# Altium schematic sheet NRV-MEM-LCD.SchDoc
size D
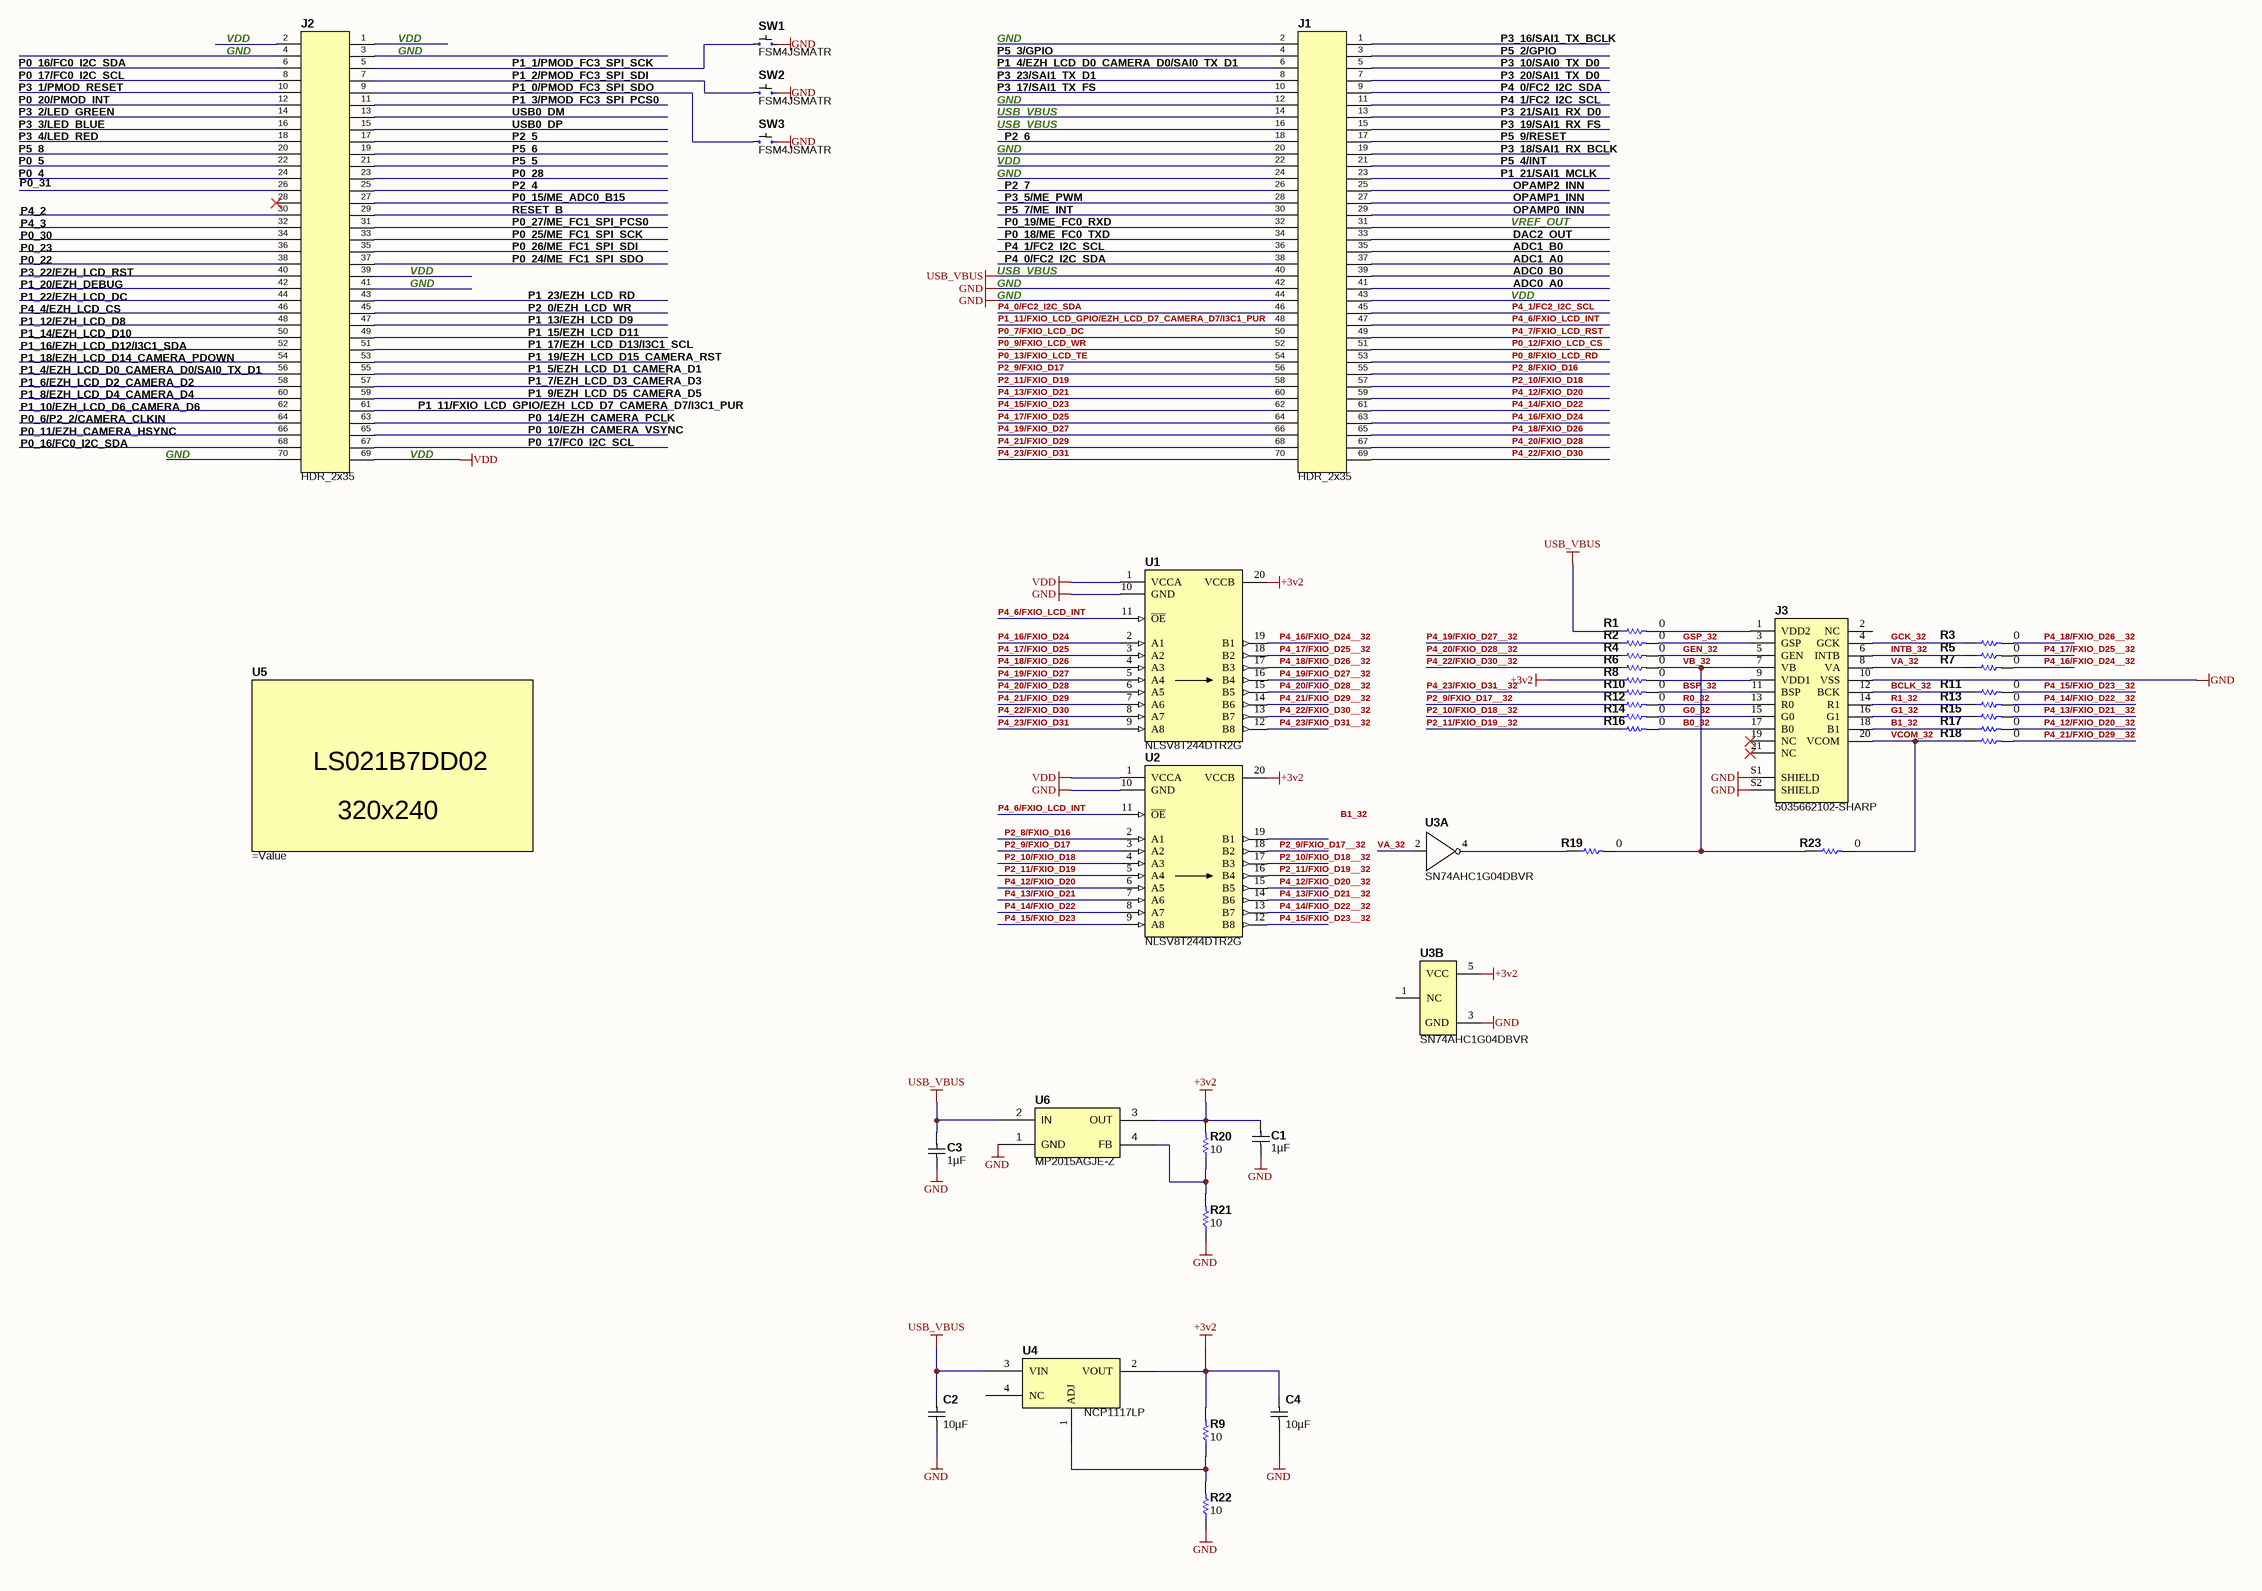
[diagram p0: NRV-MEM-LCD.SchDoc]

## Parts
C1  1µF  [C0805_1.40MM_MD]
C2  10µF  [C0805_1.40MM_MD]
C3  1µF  [C0805_1.40MM_MD]
C4  10µF  [C0805_1.40MM_MD]
J1  HDR_2x35  [HEADER 2x35 .100"]
J2  HDR_2x35  [HEADER 2x35 .100"]
J3  5035662102-SHARP  [MOLEX_5035662102]
R1  0  [R0603_0.55MM_MD]
R2  0  [R0603_0.55MM_MD]
R3  0  [R0603_0.55MM_MD]
R4  0  [R0603_0.55MM_MD]
R5  0  [R0603_0.55MM_MD]
R6  0  [R0603_0.55MM_MD]
R7  0  [R0603_0.55MM_MD]
R8  0  [R0603_0.55MM_MD]
R9  10  [R0603_0.55MM_MD]
R10  0  [R0603_0.55MM_MD]
R11  0  [R0603_0.55MM_MD]
R12  0  [R0603_0.55MM_MD]
R13  0  [R0603_0.55MM_MD]
R14  0  [R0603_0.55MM_MD]
R15  0  [R0603_0.55MM_MD]
R16  0  [R0603_0.55MM_MD]
R17  0  [R0603_0.55MM_MD]
R18  0  [R0603_0.55MM_MD]
R19  0  [R0603_0.55MM_MD]
R20  10  [R0603_0.55MM_MD]
R21  10  [R0603_0.55MM_MD]
R22  10  [R0603_0.55MM_MD]
R23  0  [R0603_0.55MM_MD]
SW1  FSM4JSMATR  [FSM4JSMA]
SW2  FSM4JSMATR  [FSM4JSMA]
SW3  FSM4JSMATR  [FSM4JSMA]
U1  NLSV8T244DTR2G  [TSOP65P640X105-20N]
U2  NLSV8T244DTR2G  [TSOP65P640X105-20N]
U3  SN74AHC1G04DBVR  [SOT95P245X145-5L]  (parts A,B of 2)
U4  NCP1117LP  [SOT223]
U5  (no value)  [LS021B7DD02]
U6  MP2015AGJE-Z  [SOT23-4]

## Nets
+3v2: C1.2 C4.2 R8.1 R9.2 R20.2 U1.20(VCCB) U2.20(VCCB) U3.5(VCC) U4.2(VOUT) U6.3(OUT)
GND: C1.1 C2.1 C3.1 C4.1 J1.42 J1.44 J3.10(VSS) J3.S1(SHIELD) J3.S2(SHIELD) R21.1 R22.1 SW1.A SW2.A SW3.A U1.10(GND) U2.10(GND) U3.3(GND) U6.1(GND)
USB_VBUS: C2.2 C3.2 J1.40 R1.1 U4.3(VIN) U6.2(IN)
VDD: J2.69 U1.1(VCCA) U2.1(VCCA)
B0_32: J3.17(B0) R16.2
B1_32: J3.18(B1) R17.1
BCLK_32: J3.12(BCK) R11.1
BSP_32: J3.11(BSP) R10.2
G0_32: J3.15(G0) R14.2
G1_32: J3.16(G1) R15.1
GCK_32: J3.4(GCK) R3.1
GEN_32: J3.5(GEN) R4.2
GSP_32: J3.3(GSP) R2.2
INTB_32: J3.6(INTB) R5.1
P0_7/FXIO_LCD_DC: J1.50
P0_8/FXIO_LCD_RD: J1.53
P0_9/FXIO_LCD_WR: J1.52
P0_12/FXIO_LCD_CS: J1.51
P0_13/FXIO_LCD_TE: J1.54
P1_11/FXIO_LCD_GPIO/EZH_LCD_D7_CAMERA_D7/I3C1_PUR: J1.48
P2_8/FXIO_D16: J1.55 U2.2(A1)
P2_9/FXIO_D17: J1.56 U2.3(A2)
P2_9/FXIO_D17__32: R12.1 U2.18(B2)
P2_10/FXIO_D18: J1.57 U2.4(A3)
P2_10/FXIO_D18__32: R14.1 U2.17(B3)
P2_11/FXIO_D19: J1.58 U2.5(A4)
P2_11/FXIO_D19__32: R16.1 U2.16(B4)
P4_0/FC2_I2C_SDA: J1.46
P4_1/FC2_I2C_SCL: J1.45
P4_6/FXIO_LCD_INT: J1.47 U1.11(~{OE}) U2.11(~{OE})
P4_7/FXIO_LCD_RST: J1.49
P4_12/FXIO_D20: J1.59 U2.6(A5)
P4_12/FXIO_D20__32: R17.2 U2.15(B5)
P4_13/FXIO_D21: J1.60 U2.7(A6)
P4_13/FXIO_D21__32: R15.2 U2.14(B6)
P4_14/FXIO_D22: J1.61 U2.8(A7)
P4_14/FXIO_D22__32: R13.2 U2.13(B7)
P4_15/FXIO_D23: J1.62 U2.9(A8)
P4_15/FXIO_D23__32: R11.2 U2.12(B8)
P4_16/FXIO_D24: J1.63 U1.2(A1)
P4_16/FXIO_D24__32: R7.2 U1.19(B1)
P4_17/FXIO_D25: J1.64 U1.3(A2)
P4_17/FXIO_D25__32: R5.2 U1.18(B2)
P4_18/FXIO_D26: J1.65 U1.4(A3)
P4_18/FXIO_D26__32: R3.2 U1.17(B3)
P4_19/FXIO_D27: J1.66 U1.5(A4)
P4_19/FXIO_D27__32: R2.1 U1.16(B4)
P4_20/FXIO_D28: J1.67 U1.6(A5)
P4_20/FXIO_D28__32: R4.1 U1.15(B5)
P4_21/FXIO_D29: J1.68 U1.7(A6)
P4_21/FXIO_D29__32: R18.2 U1.14(B6)
P4_22/FXIO_D30: J1.69 U1.8(A7)
P4_22/FXIO_D30__32: R6.1 U1.13(B7)
P4_23/FXIO_D31: J1.70 U1.9(A8)
P4_23/FXIO_D31__32: R10.1 U1.12(B8)
R0_32: J3.13(R0) R12.2
R1_32: J3.14(R1) R13.1
VA_32: J3.8(VA) R7.1 U3.2(A)
VB_32: J3.7(VB) R6.2 R19.2 R23.1
VCOM_32: J3.20(VCOM) R18.1 R23.2
NetJ2_5: J2.5 SW1.B
NetJ2_7: J2.7 SW2.B
NetJ2_9: J2.9 SW3.B
NetJ3_1: J3.1(VDD2) R1.2
NetJ3_9: J3.9(VDD1) R8.2
NetR9_1: R9.1 R22.2 U4.1(ADJ)
NetR19_1: R19.1 U3.4(OUT)
NetR20_1: R20.1 R21.2 U6.4(FB)

Not connected (* = marked no-connect by the designer): J1 1 2 3 4 5 6 7 8 9 10 11 12 13 14 15 16 17 18 19 20 21 22 23 24 25 26 27 28 29 30 31 32 33 34 35 36 37 38 39 41 43; J2 1 2 3 4 6 8 10 11 12 13 14 15 16 17 18 19 20 21 22 23 24 25 26 27 28* 29 30 31 32 33 34 35 36 37 38 39 40 41 42 43 44 45 46 47 48 49 50 51 52 53 54 55 56 57 58 59 60 61 62 63 64 65 66 67 68 70; J3 2(NC) 19(NC)* 21(NC)*; U2 19(B1); U3 1(NC); U4 4(NC)

## Notes on the sheet
- VDD
- GND
- (near J2) VDD
- (near J2) GND
- P5_3/GPIO
- P3_16/SAI1_TX_BCLK
- P5_2/GPIO
- P0_16/FC0_I2C_SDA
- P0_17/FC0_I2C_SCL
- P3_1/PMOD_RESET
- P0_20/PMOD_INT
- P3_2/LED_GREEN
- P1_1/PMOD_FC3_SPI_SCK
- P1_2/PMOD_FC3_SPI_SDI
- P1_0/PMOD_FC3_SPI_SDO
- P1_3/PMOD_FC3_SPI_PCS0
- USB0_DM
- P1_4/EZH_LCD_D0_CAMERA_D0/SAI0_TX_D1
- P3_23/SAI1_TX_D1
- P3_17/SAI1_TX_FS
- USB_VBUS
- P3_10/SAI0_TX_D0
- P3_20/SAI1_TX_D0
- P4_0/FC2_I2C_SDA
- P4_1/FC2_I2C_SCL
- P3_21/SAI1_RX_D0
- P3_3/LED_BLUE
- P3_4/LED_RED
- P5_8
- P0_5
- P0_4
- USB0_DP
- P2_5
- P5_6
- P5_5
- P0_28
- P2_6
- P3_19/SAI1_RX_FS
- P5_9/RESET
- P3_18/SAI1_RX_BCLK
- P5_4/INT
- P1_21/SAI1_MCLK
- P0_31
- P4_2
- P4_3
- P0_30
- P2_4
- P0_15/ME_ADC0_B15
- RESET_B
- P0_27/ME_FC1_SPI_PCS0
- P0_25/ME_FC1_SPI_SCK
- P2_7
- P3_5/ME_PWM
- P5_7/ME_INT
- P0_19/ME_FC0_RXD
- P0_18/ME_FC0_TXD
- VREF_OUT
- OPAMP2_INN
- OPAMP1_INN
- OPAMP0_INN
- DAC2_OUT
- P0_23
- P0_22
- P3_22/EZH_LCD_RST
- P1_20/EZH_DEBUG
- P1_22/EZH_LCD_DC
- P0_26/ME_FC1_SPI_SDI
- P0_24/ME_FC1_SPI_SDO
- P1_23/EZH_LCD_RD
- ADC1_B0
- ADC1_A0
- ADC0_B0
- ADC0_A0
- P4_4/EZH_LCD_CS
- P1_12/EZH_LCD_D8
- P1_14/EZH_LCD_D10
- P1_16/EZH_LCD_D12/I3C1_SDA
- P1_18/EZH_LCD_D14_CAMERA_PDOWN
- P2_0/EZH_LCD_WR
- P1_13/EZH_LCD_D9
- P1_15/EZH_LCD_D11
- P1_17/EZH_LCD_D13/I3C1_SCL
- P1_19/EZH_LCD_D15_CAMERA_RST
- P1_6/EZH_LCD_D2_CAMERA_D2
- P1_8/EZH_LCD_D4_CAMERA_D4
- P1_10/EZH_LCD_D6_CAMERA_D6
- P0_6/P2_2/CAMERA_CLKIN
- P1_11/FXIO_LCD_GPIO/EZH_LCD_D7_CAMERA_D7/I3C1_PUR
- P1_5/EZH_LCD_D1_CAMERA_D1
- P1_7/EZH_LCD_D3_CAMERA_D3
- P1_9/EZH_LCD_D5_CAMERA_D5
- P0_14/EZH_CAMERA_PCLK
- P0_11/EZH_CAMERA_HSYNC
- P0_10/EZH_CAMERA_VSYNC
- Labels drawn without touching a wire or pin: B1_32
- PCB REV
- CCA REV
- Sheet
- of
- (in symbol LS021B7DD02) 320x240

## Library data of the parts
C1 C3 = GCM21BR71C105KA58K: CAP CER 1UF 16V X7R 0805; Manufacturer: Murata Electronics; Tolerance: ±10%; Substitution Notes: 1µF , 16V , ±10% , X7R , -55°C ~ 125°C , AEC-Q200 , 0805; Value: 1µF; Temperature Coefficient: X7R; Manufacturer Part Number: GCM21BR71C105KA58K; ComponentLink1Description: Datasheet (Internal); ComponentLink1URL: https://search.murata.co.jp/Ceramy/image/img/A01X/G101/ENG/GCM21BR71C105KA58-01.pdf; ComponentLink2Description: Datasheet (External); ComponentLink2URL: https://search.murata.co.jp/Ceramy/image/img/A01X/G101/ENG/GCM21BR71C105KA58-01.pdf; Supplier 1: Digikey; Supplier Part Number 1: 490-16269-1-ND; Category: Capacitors; Voltage - Rated: 16V; Operating Temperature: -55°C ~ 125°C; Ratings: AEC-Q200; Package: 0805; Thickness (Max): 1.40MM
C2 C4 = GCM21BR71A106KE22K: CAP CER 10UF 10V X7R 0805; Manufacturer: Murata Electronics; Tolerance: ±10%; Substitution Notes: 10µF , 10V , ±10% , X7R , -55°C ~ 125°C , AEC-Q200 , 0805; Value: 10µF; Temperature Coefficient: X7R; Manufacturer Part Number: GCM21BR71A106KE22K; ComponentLink1Description: Datasheet (Internal); ComponentLink1URL: https://search.murata.co.jp/Ceramy/image/img/A01X/G101/ENG/GCM21BR71A106KE22-01.pdf; ComponentLink2Description: Datasheet (External); ComponentLink2URL: https://search.murata.co.jp/Ceramy/image/img/A01X/G101/ENG/GCM21BR71A106KE22-01.pdf; Supplier 1: Digikey; Supplier Part Number 1: 490-14531-1-ND; Category: Capacitors; Voltage - Rated: 10V; Operating Temperature: -55°C ~ 125°C; Ratings: AEC-Q200; Package: 0805; Thickness (Max): 1.40MM
J1 J2 = HDR_2x35: 2x35 Header .100"; Value: HDR_2x35; Supplier 1: Digi-Key; Supplier Part Number 1: 1849-PR20204VBDN-ND; RoHS: No; Stock: 3387; Pricing: 1=0.16000, 10=0.15400, 100=0.09510, 500=0.07872, 1000=0.06888, 5000=0.05904, 10000=0.05740 (USD)
J3 = 5035662102-SHARP: 21 Position FPC Connector Contacts, Bottom 0.012 (0.30mm) Surface Mount, Right Angle; Manufacturer: Molex; Package: None; Value: *; Manufacturer Part Number: 5035662102; Availability: In Stock; Price: None; SnapEDA_Link: https://www.snapeda.com/parts/5035662102/Molex/view-part/6250786/?ref=snap; Check_prices: https://www.snapeda.com/parts/5035662102/Molex/view-part/6250786/?ref=eda
R1-R8 R10-R19 R23 = ERJ-3GEY0R00V: RES 0.0 OHM 1/10W JUMP 0603 SMD; Manufacturer: Panasonic Electronic Components; Package Power: 0603  (0.1W); Power (Watts): 0.1W- 1/10W; Tolerance: Jumper; Limiting Element Voltage: 75; Maximum Overload Voltage: 150; Maximum Working Voltage: 0.0V; Substitution Notes: 0 , Jumper , 0603 , AEC-Q200; Value: 0; Manufacturer Part Number: ERJ-3GEY0R00V; ComponentLink1Description: Internal Datasheet; ComponentLink1URL: datasheets\Panasonic Electronic Components\AOA0000CE1.pdf; ComponentLink2Description: External Datasheet; ComponentLink2URL: http://industrial.panasonic.com/www-data/pdf/AOA0000/AOA0000CE1.pdf; Supplier 1: Digi-Key; Supplier Part Number 1: P0.0GCT-ND; Category: Resistors; Resistance (Ohms): 0; Composition: Thick Film; Features: -; Temperature Coefficient: -; Package: 0603 (1608 Metric); Supplier Package: 0603; Size / Dimension: 0.063" L x 0.031" W (1.60mm x 0.80mm); Height: 0.55MM; Number of Terminations: 2; Sort Value: 0; Sort Value Package: 603_0; Ratings: AEC-Q200
R9 R20-R22 = R: RES 10.0 OHM 1/10W 1% 0603 SMD; Value: RES 10.0 OHM 1/10W 1% 0603 SMD; ComponentLink1URL: http://industrial.panasonic.com/www-cgi/jvcr13pz.cgi?E+PZ+3+AOA0002+ERJ3EKF10R0V+7+WW; ComponentLink1Description: http://industrial.panasonic.com/www-cgi/jvcr13pz.cgi?E+PZ+3+AOA0002+ERJ3EKF10R0V+7+WW
SW1-SW3 = FSM4JSMATR: SWITCH TACTILE SPST-NO 0.05A 12V; Manufacturer: TE Connectivity; Switch Function: Off-Mom; Contact Rating @ Voltage: 0.05A @ 12VDC; Actuator Type: Standard; Actuator Orientation: Top Actuated; Outline: 6.00mm x 6.00mm; Illumination: Non-Illuminated; Operating Force: 160gf; Supplier 1: Digi-Key; Supplier Part Number 1: 450-1759-1-ND; Manufacturer Part Number: FSM4JSMATR; RoHS: RoHS Compliant; Category: Switches; Stock 1: 35617; Pricing 1: 1=0.36, 10=0.34, 25=0.2912, 50=0.2474, 100=0.2377, 250=0.21344, 500=0.20374 (USD); Circuit: SPST-NO; Mounting Type: Surface Mount; Termination Style: Gull Wing; Packaging: Cut Tape (CT); ComponentLink1URL: http://documents.tycoelectronics.com/commerce/DocumentDelivery/DDEController?Action=srchrtrv&DocNm=2-1437565-7&DocType=CD&DocLang=EN; ComponentLink1Description: http://documents.tycoelectronics.com/commerce/DocumentDelivery/DDEController?Action=srchrtrv&DocNm=2-1437565-7&DocType=CD&DocLang=EN; Value: FSM4JSMATR
U1 U2 = NLSV8T244DTR2G: NLSV8T244 Series 8 Bit 0.9 to 4.5 V Dual Non Inverting Level Translator-TSSOP-20; Value: Manufacturer; Package: None; Price: None; Manufacturer Part Number: NLSV8T244DTR2G; Availability: Unavailable
U3 = SN74AHC1G04DBVR: IC SINGLE INVERTER GATE SOT23-5; Manufacturer: Texas Instruments; Source Part Number: 296-1089-1-ND; Number of Circuits: 1; Voltage - Supply: 2 V ~ 5.5 V; Current - Quiescent (Max): 1µA; Current - Output High, Low: 8mA, 8mA; Logic Level - Low: 0.5 V ~ 1.65 V; Logic Level - High: 1.5 V ~ 3.85 V; Max Propagation Delay @ V, Max CL: 7.5ns @ 5V, 50pF; Manufacturer Part Number: SN74AHC1G04DBVR; Source: Digikey; ROHS Certificate: *; Value: SN74AHC1G04DBVR; Supplier 1: Digi-Key; Supplier Part Number 1: 296-1089-1-ND; RoHS: RoHS Compliant; Category: Integrated Circuits (ICs); Stock 1: 17063; Pricing 1: 1=0.49, 10=0.284, 100=0.134, 1000=0.103 (USD); Packaging: Cut Tape (CT); Logic Type: Inverter; Number of Inputs: 1; Features: -; Operating Temperature: -40°C ~ 85°C; Mounting Type: Surface Mount; Supplier Device Package: SOT-23-5; Package / Case: SC-74A, SOT-753; ComponentLink1URL: http://www.ti.com/lit/ds/symlink/sn74ahc1g04.pdf; ComponentLink1Description: http://www.ti.com/lit/ds/symlink/sn74ahc1g04.pdf
U4 = NCP1117LP: LDO Regulator Pos 1A 4-Pin(3+Tab) SOT-223 T/R / IC REG LDO ADJ 1A SOT223; Manufacturer: ON Semiconductor; Manufacturer Part Number: NCP1117LPSTADT3G; Number of Outputs: 1; Min Input Voltage: -300mV; Max Supply Voltage: 18V; Polarity: Positive; Quiescent Current: 50uA; Output Type: Adjustable; Dropout Voltage: 1.3V; Output Voltage: 5V; Min Current Limit: 1.1A; Reference Voltage: 1.25V; Power Supply Rejection Ratio (PSRR): 60dB; Supplier 1: Digi-Key; Supplier Part Number 1: NCP1117LPSTADT3GOSCT-ND; RoHS: Yes; Category: Voltage Regulators - Linear; Stock 1: 11739; Pricing: 1=0.45000, 10=0.38800, 25=0.36240, 100=0.29000, 250=0.26928, 500=0.22784, 1000=0.17606 (USD); Mounting Technology: Surface Mount; Case/Package: SOT-223; Pins: 4; Min Operating Temperature: 0°C; Max Operating Temperature: 125°C; Packaging: Tape and Reel; Package Quantity: 4000; Output Current: 1A; Max Output current: 1A; Number of Regulators: 1; Series: -; Length: 6.7mm; Width: 3.7mm; Height: 1.69mm; Radiation Hardening: No; Reach SVHC Compliant: Yes; Lead Free: Lead Free; Halogen Free: Halogen Free; RoHS Compliant: Yes; ComponentLink1URL: https://datasheet.ciiva.com/30476/0900766b8124f872-30476979.pdf?src-supplier=RSComponents; ComponentLink1Description: https://datasheet.ciiva.com/30476/0900766b8124f872-30476979.pdf?src-supplier=RSComponents; ComponentLink2URL: https://datasheet.ciiva.com/16468/ncp1117lp-d-16468568.pdf?src-supplier=Future+Electronics; ComponentLink2Description: https://datasheet.ciiva.com/16468/ncp1117lp-d-16468568.pdf?src-supplier=Future+Electronics; ComponentLink3URL: https://datasheet.ciiva.com/8233/ncp1117lp-d-8233564.pdf?src-supplier=Avnet; ComponentLink3Description: https://datasheet.ciiva.com/8233/ncp1117lp-d-8233564.pdf?src-supplier=Avnet; Value: NCP1117LP
U5 = LS021B7DD02: LCD Display Module 5.4-in 240xRGBx320 45uW; Manufacturer: Sharp; Supplier 1: Avnet; Supplier Part Number 1: LS021B7DD02; Manufacturer Part Number: LS021B7DD02; Pricing: 480=31.17562, 960=30.71640, 1920=30.07200, 2880=29.21280, 3840=28.56840, 4800=27.49440, 48000=26.85000 (USD)
U6 = MP2015AGJE-Z: LDO Voltage Regulators 24V LowQuies Current Linear Regulator; Manufacturer: Monolithic Power Systems; Supplier 1: Digi-Key; Supplier Part Number 1: 1589-1556-1-ND; Manufacturer Part Number: MP2015AGJE-Z; RoHS: Yes; Category: Voltage Regulators - Linear; Stock 1: 7147; Pricing: 1=1.12000, 10=1.00100, 25=0.94960, 100=0.78020, 250=0.72928, 500=0.64448, 1000=0.50880 (USD); Value: MP2015AGJE-Z